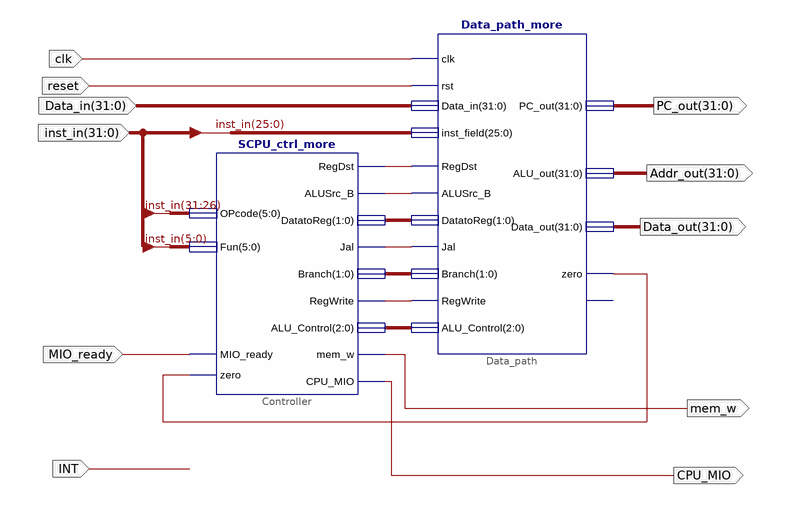
[diagram p0: schematic sheet 1]
// Xilinx ISE schematic SCPU.sch (spartan6) as structural Verilog: 2 symbols, 11 ports
module SCPU (
  input  reset,
  input  clk,
  input  [31:0] Data_in,
  input  [31:0] inst_in,
  input  INT,
  input  MIO_ready,
  output [31:0] PC_out,
  output [31:0] Addr_out,
  output [31:0] Data_out,
  output mem_w,
  output CPU_MIO
);

  wire ALUSrc_B, Jump, RegDst, RegWrite, XLXN_2;
  wire [1:0] Branch, DatatoReg;
  wire [2:0] ALU_Control;

  SCPU_ctrl_more Controller (
    .RegDst(RegDst), .ALUSrc_B(ALUSrc_B), .DatatoReg(DatatoReg), .Jal(Jump), .Branch(Branch),
    .RegWrite(RegWrite), .ALU_Control(ALU_Control), .CPU_MIO(CPU_MIO), .mem_w(mem_w), .Fun(inst_in[5:0]),
    .OPcode(inst_in[31:26]), .zero(XLXN_2), .MIO_ready(MIO_ready));
  Data_path_more Data_path (
    .RegDst(RegDst), .ALUSrc_B(ALUSrc_B), .DatatoReg(DatatoReg), .Jal(Jump), .Branch(Branch),
    .RegWrite(RegWrite), .ALU_Control(ALU_Control), .Data_in(Data_in), .inst_field(inst_in[25:0]), .clk(clk),
    .rst(reset), .PC_out(PC_out), .ALU_out(Addr_out), .Data_out(Data_out), .zero(XLXN_2));  // open: overflow
endmodule
